# EAGLE design AST1002 (EAGLE 6.3)
DATABASE: ./../../../../../Components/TinyCircuits_Part_Database.txt
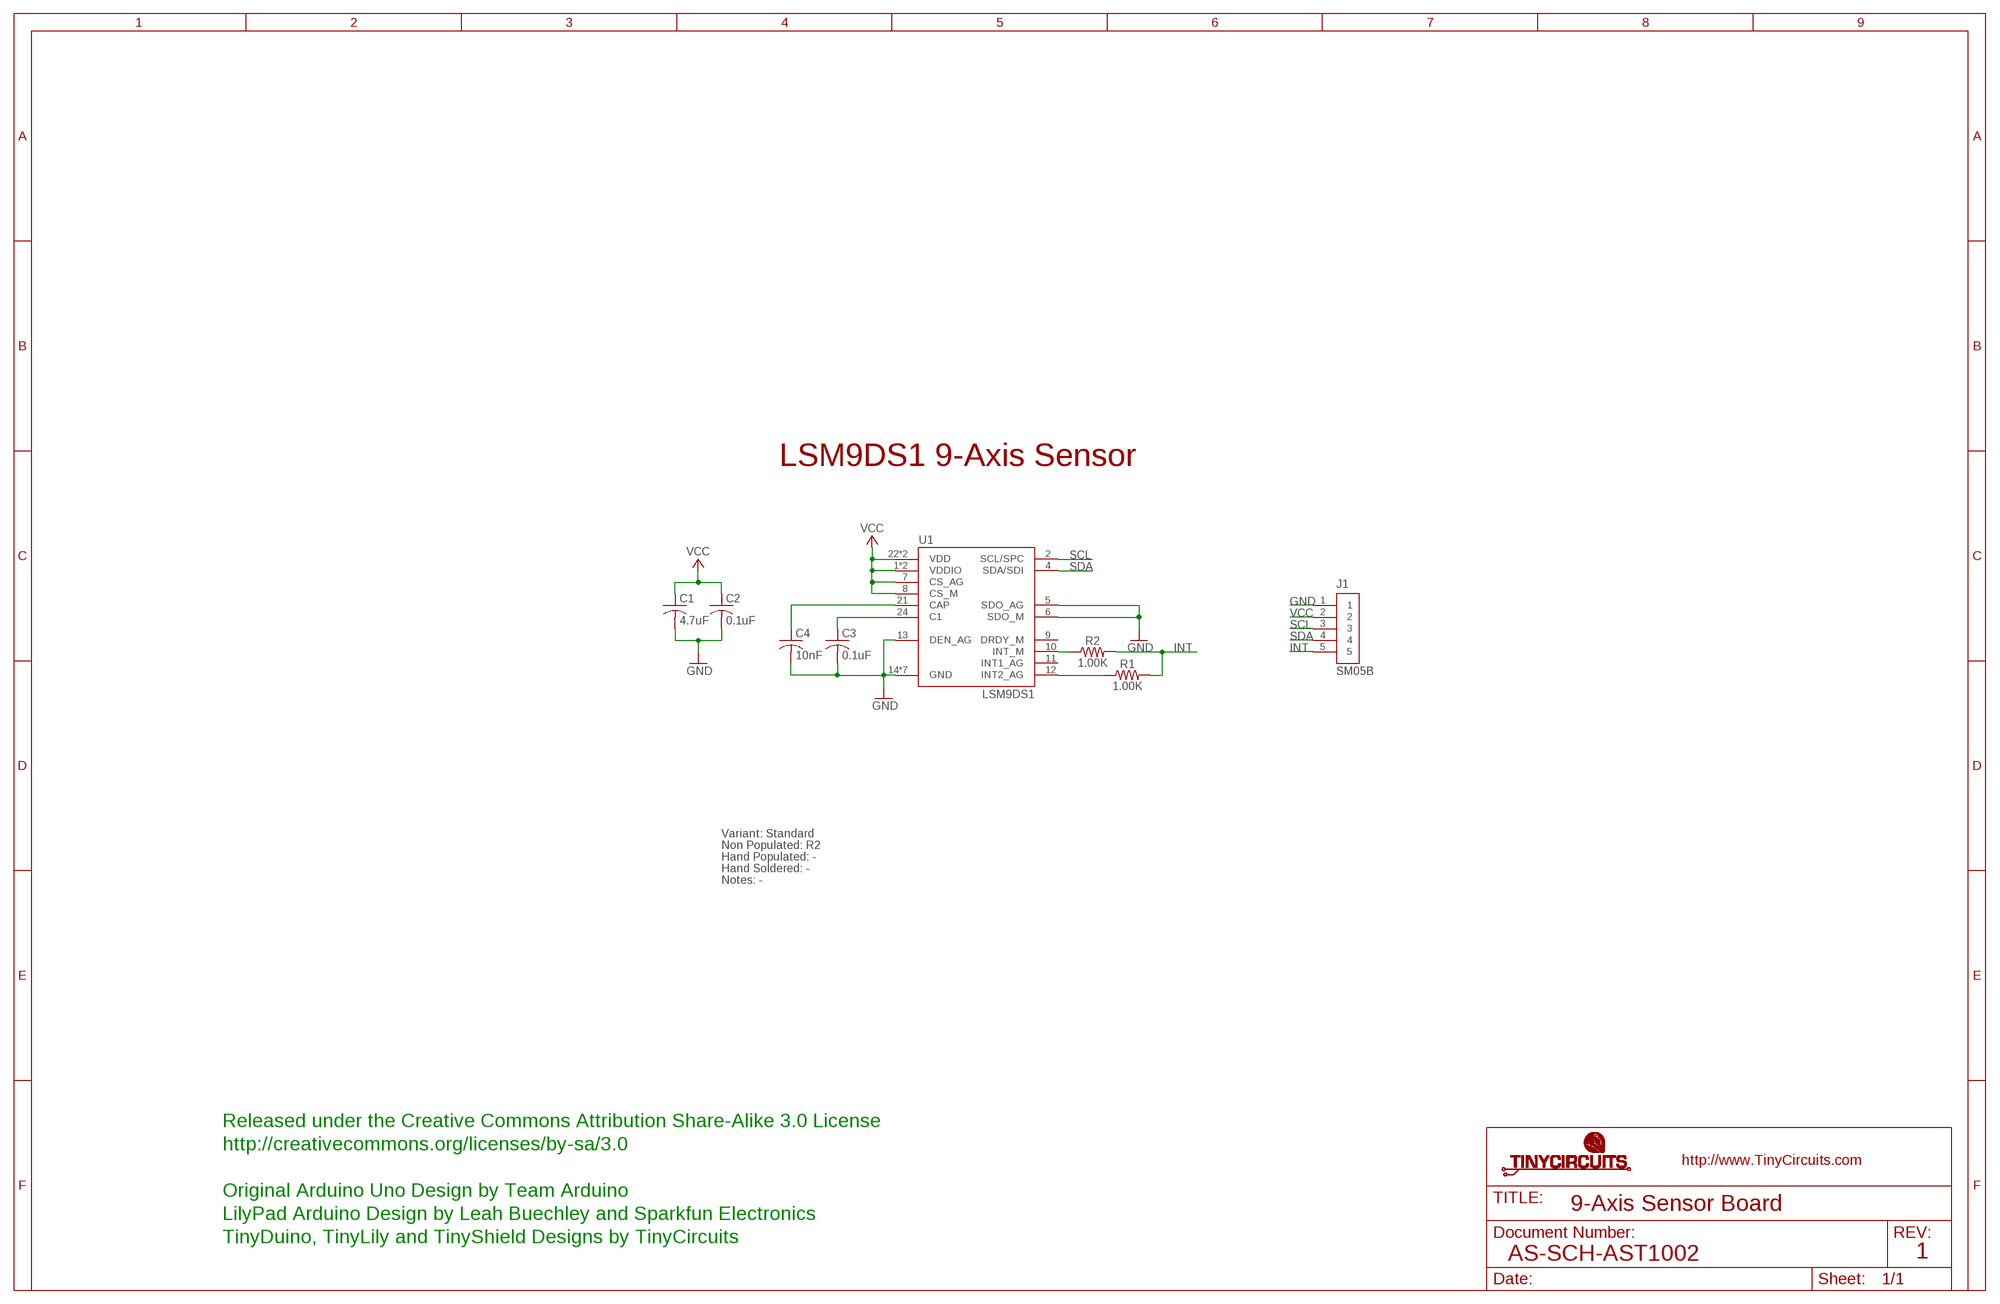
[diagram p0: schematic, sheet 1]

## Parts
C1  4.7uF  AS-ITM-00088  [C0603]
C2  0.1uF  AS-ITM-00008  [C0402]
C3  0.1uF  AS-ITM-00008  [C0402]
C4  10nF  AS-ITM-00084  [C0402]
J1  SM05B  AS-ITM-00340EDGE  [JST_SH_5X1_EDGE]
R1  1.00K  AS-ITM-00003  [0402]
R2  1.00K  AS-ITM-00003  [0402]
U1  LSM9DS1  AS-ITM-00265  [LGA-24]

## Nets
GND: C1.2 C2.2 C3.2 C4.2 J1.1 U1.5(SDO_AG) U1.6(SDO_M) U1.13(DEN_AG) U1.14(GND) U1.15(GND) U1.16(GND) U1.17(GND) U1.18(GND) U1.19(GND) U1.20(GND)
INT: J1.5 R1.2 R2.2
N$1: R1.1 U1.12(INT2_AG)
N$3: C3.1 U1.24(C1)
N$4: C4.1 U1.21(CAP)
N$9: R2.1 U1.10(INT_M)
SCL: J1.3 U1.2(SCL/SPC)
SDA: J1.4 U1.4(SDA/SDI)
VCC: C1.1 C2.1 J1.2 U1.1(VDDIO) U1.3(VDDIO) U1.7(CS_AG) U1.8(CS_M) U1.22(VDD) U1.23(VDD)
Unconnected: U1.9(DRDY_M) U1.11(INT1_AG)

## Notes on the sheet
- LSM9DS1 9-Axis Sensor
- Variant: Standard
- Non Populated: R2
- Hand Populated: -
- Hand Soldered: -
- Notes: -
- Released under the Creative Commons Attribution Share-Alike 3.0 License
- http://creativecommons.org/licenses/by-sa/3.0
- Original Arduino Uno Design by Team Arduino
- 9-Axis Sensor Board
- LilyPad Arduino Design by Leah Buechley and Sparkfun Electronics
- TinyDuino, TinyLily and TinyShield Designs by TinyCircuits
- AS-SCH-AST1002 | 1

## Library data of the parts
C1 = tinycircuits:AS-ITM-00088: CAP CER 4.7UF 6.3V 20% X5R 0603; PARTNO: AS-ITM-00088
C2 C3 = tinycircuits:AS-ITM-00008: CAP CER 0.1UF 16V 10% X5R 0402; PARTNO: AS-ITM-00008
C4 = tinycircuits:AS-ITM-00084: CAP CER 10NF 25V 10% X7R 0402; PARTNO: AS-ITM-00084
J1 = tinycircuits:AS-ITM-00340: CONN HEADER SH 5POS SIDE 1MM TIN; PARTNO: AS-ITM-00340; PNPROTATION: 180
R1 R2 = tinycircuits:AS-ITM-00003: RES 1.00K OHM 1/16W 1% 0402; PARTNO: AS-ITM-00003
U1 = tinycircuits:AS-ITM-00265: 9 AXIS ACCEL GYRO MAG 3D INEMO 24TFLGA; PARTNO: AS-ITM-00265; PNPROTATION: 0

## Net classes
2 gnd: width 0.305 mm, drill 0.559 mm, clearance 0.254 mm

## Board
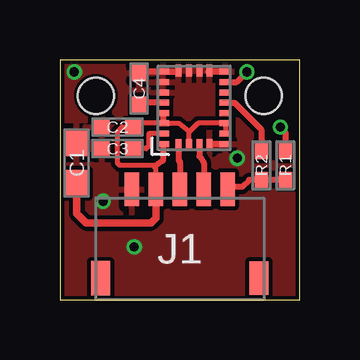
[diagram p1: board, top side]
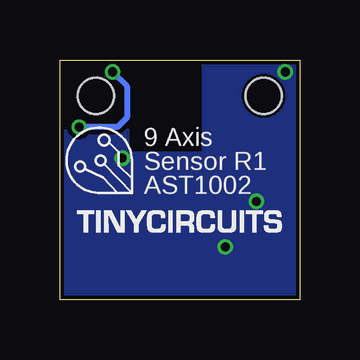
[diagram p2: board, bottom side, seen from below]

Size 10 x 10 mm. Coordinates in mm from the lower left corner, seen from the top.
Outline: 0,0 10,0 10,10 0,10 0,0
Copper layers (1*16): Top 0.035mm / dielectric 1.5mm / Bottom 0.035mm
Design rules "default *": minimum track width 8mil, minimum drill 15mil, track to track 7mil, track to pad 7mil, pad to pad 7mil, via to via 7mil, smd to smd 7mil, copper to edge 6mil, drill to drill 8mil, minimum pad ring 8mil, minimum via ring 5mil, stop-mask expansion 4mil, vias tented up to drill 25mil, thermal gap 10mil
Holes 1.5 mm at 1.5,8.5 8.5,8.5
bKeepout: area 4.6,6.8 to 6.4,9.2
bRestrict: area 4.1,6.2 to 7.1,9.8

### Footprints (pad centres in the part's own frame; a part is rotated, then mirrored left to right if it is on the bottom)
C0603 = smd 1.1 x 1: 1 -0.85,0; 2 0.85,0
C0402 = smd 0.65 x 0.6: 1 -0.65,0; 2 0.65,0
JST_SH_5X1_EDGE = smd 0.6 x 1.4: 1 -2,2.475; 2 -1,2.475; 3 0,2.475; 4 1,2.475; 5 2,2.475 | smd 0.8 x 1.4: PAD1 -3.3,-1.225; PAD2 3.3,-1.225
0402 = smd 0.65 x 0.55: 1 -0.6,0; 2 0.6,0
LGA-24 = smd 0.25 x 0.5: 1 -1.505,1.3; 6 -1.505,-1.3; 7 -1.075,-1.3; 8 -0.645,-1.3; 9 -0.215,-1.3; 10 0.215,-1.3; 11 0.645,-1.3; 12 1.075,-1.3; 13 1.505,-1.3; 18 1.505,1.3; 19 1.075,1.3; 20 0.645,1.3; 21 0.215,1.3; 22 -0.215,1.3; 23 -0.645,1.3; 24 -1.075,1.3 | smd 0.5 x 0.25: 2 -1.55,0.645; 3 -1.55,0.215; 4 -1.55,-0.215; 5 -1.55,-0.645; 14 1.55,-0.645; 15 1.55,-0.215; 16 1.55,0.215; 17 1.55,0.645

### Placement (x,y rotation side)
C1  0.7,5.7 90 top
C2  2.4,7.2 180 top
C3  2.4,6.3 180 top
C4  3.3,8.8 90 top
J1  5,2.12 0 top
R1  9.4,5.6 270 top
R2  8.4,5.6 270 top
U1  5.6,8 90 top
U$1  [DOCFIELD-TINYCIRCUITS-PCB]  19,-10 0 top  (outside the outline)

### Tracks (layer width: path | path; a pad name or v marks a point on that pad's centre or on a via)
GND  (via drill 0.38)
  Top 0.254: C4.2 3.36,9.5 U1.18 4.81,9.5 U1.17 | U1.13 6.19,9.5 U1.14 | U1.6 6.29,6.5 U1.5
  other vias: 3.1,2.2 1.8,4.1 7.4,5.9 0.6,9.5
  pour Bottom: 0,10 10,10 10,0 0,0
  pour Top: 0,10 10,10 10,0 0,0
INT
  Top 0.254: R1.2 R2.2 7.9,5 7.6,4.7 7.1,4.7 J1.5
N$1  (via drill 0.38)
  Top 0.254: U1.12 7.38,9.07 v7.8,9.5 | v9.2,7.2 9.4,7 R1.1
  Bottom 0.254: v7.8,9.5 7.2,8.9 7.2,7.6 7.6,7.2 v9.2,7.2
N$3
  Top 0.203: U1.24 3.73,6.93 3.7,6.9 3.7,6.4 3.6,6.3 C3.1
N$4
  Top 0.254: U1.21 3.36,8.21 C4.1
N$9
  Top 0.254: U1.10 7.29,8.21 8.4,7.1 R2.1
SCL
  Top 0.254: J1.3 5,4.5 4.9,4.6 | 4.9,4.7 J1.3 | U1.2 4.95,5.85 5,5.7 J1.3
SDA
  Top 0.254: U1.4 5.82,5.98 6,5.7 J1.4
VCC
  Top 0.203: U1.7 U1.8 5.75,7.36 5.39,6.98 | 5.39,6.98 5.39,7.02 4.95,7.36 U1.23 3.3,7.36 C2.1 2.6,7.2 2.4,7 2.4,5.7 2.5,5.6 3.9,5.6 3.95,5.55 4,5.5 J1.2 | U1.3 5.39,6.98
  Top 0.254: U1.22 U1.23 | U1.1 4.3,5.8 3.95,5.55
  Top 0.305: C1.1 0.7,3.6 1.1,3.2 3.8,3.2 4,3.4 J1.2

### Text on the board
bPlace: 9 Axis | Sensor R1 | AST1002
Document: FABRICATION DRAWING | NOTES: | 1. PRINTED CIRCUIT BOARD MADE FROM NEMA GRADE FR-4 EPOXY LAMINATE | WITH 1 OUNCE COPPER PLATING AND .024 THICKNESS. | 2. ALL DIMENSIONS ARE GIVEN IN MILLIMETERS. | 3. CIRCUIT PATHS ARE FOR REFERENCE ONLY. | 4. HOLE SIZES SHOWN ARE FINISHED DIAMETERS AFTER PLATING. | 5. BOARD PLATED USING REFLOW OR SIMILAR METHOD. | 6. BOARD TO HAVE BLUE SOLDER MASK ON PLATED SURFACES USING WET FILM | 7. SILKSCREEN BOARD USING WHITE INK. | SR100 OR SR1010 EPOXY. EQUIVALENT WET OR DRY FILM MAY BE USED. | 8. THE FOLLOWING INFORMATION APPLIES TO THIS BOARD: | * 2 COPPER LAYERS | * .024 BOARD THICKNESS | * REQUIRES TOP SIDE SILKSCREEN | Released under the Creative Commons Attribution Share-Alike 3.0 License | http://creativecommons.org/licenses/by-sa/3.0 | Original Arduino Uno Design by Team Arduino | LilyPad Arduino Design by Leah Buechley and Sparkfun Electronics | TinyDuino, TinyLily and TinyShield Designs by TinyCircuits | 9-Axis Sensor Board | AS-PCB-AST1002 | 1